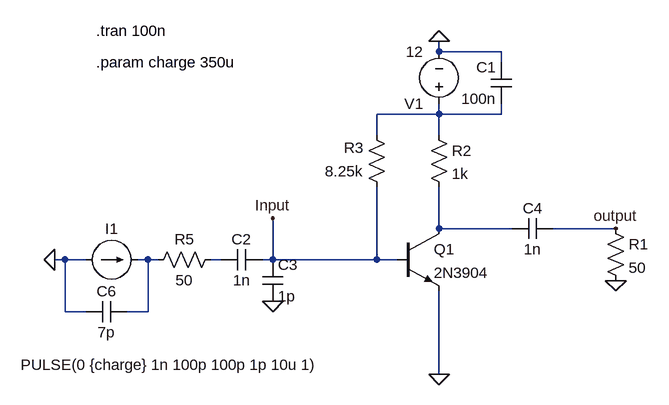
[diagram p0: schematic BGA2803_based_amplifier.asc]
BGA2803_based_amplifier.asc, the LTspice schematic file:
Version 4
SHEET 1 1152 784
WIRE 672 112 672 96
WIRE 768 112 672 112
WIRE 768 128 768 112
WIRE 672 208 672 192
WIRE 672 208 576 208
WIRE 768 208 768 192
WIRE 768 208 672 208
WIRE 576 240 576 208
WIRE 672 240 672 208
WIRE 672 384 672 320
WIRE 784 384 672 384
WIRE 944 384 848 384
WIRE 96 432 80 432
WIRE 128 432 96 432
WIRE 224 432 208 432
WIRE 240 432 224 432
WIRE 336 432 320 432
WIRE 416 432 416 368
WIRE 416 432 400 432
WIRE 576 432 576 320
WIRE 576 432 416 432
WIRE 608 432 576 432
WIRE 96 512 96 432
WIRE 128 512 96 512
WIRE 224 512 224 432
WIRE 224 512 192 512
WIRE 672 608 672 480
FLAG 672 96 0
FLAG 416 496 0
FLAG 672 608 0
FLAG 80 432 0
FLAG 416 368 Input
FLAG 944 384 output
FLAG 944 464 0
SYMBOL voltage 672 208 R180
WINDOW 123 0 0 Left 0
WINDOW 39 0 0 Left 0
SYMATTR InstName V1
SYMATTR Value 12
SYMBOL cap 784 192 R180
WINDOW 0 24 56 Left 2
WINDOW 3 24 8 Left 2
SYMATTR InstName C1
SYMATTR Value 100n
SYMBOL cap 400 416 R90
WINDOW 0 0 32 VBottom 2
WINDOW 3 32 32 VTop 2
SYMATTR InstName C2
SYMATTR Value 1n
SYMBOL cap 400 432 R0
SYMATTR InstName C3
SYMATTR Value 1p
SYMBOL cap 848 368 R90
WINDOW 0 0 32 VBottom 2
WINDOW 3 32 32 VTop 2
SYMATTR InstName C4
SYMATTR Value 1n
SYMBOL res 928 368 R0
SYMATTR InstName R1
SYMATTR Value 50
SYMBOL npn 608 384 R0
SYMATTR InstName Q1
SYMATTR Value 2N3904
SYMBOL res 656 224 R0
SYMATTR InstName R2
SYMATTR Value 1k
SYMBOL current 128 432 R270
WINDOW 0 32 40 VTop 2
WINDOW 3 -146 131 VBottom 2
WINDOW 123 0 0 Left 0
WINDOW 39 0 0 Left 0
SYMATTR InstName I1
SYMATTR Value PULSE(0 {charge} 1n 100p 100p 1p 10u 1)
SYMBOL cap 192 496 R90
WINDOW 0 0 32 VBottom 2
WINDOW 3 32 32 VTop 2
SYMATTR InstName C6
SYMATTR Value 7p
SYMBOL res 336 416 R90
WINDOW 0 0 56 VBottom 2
WINDOW 3 32 56 VTop 2
SYMATTR InstName R5
SYMATTR Value 50
SYMBOL res 592 336 R180
WINDOW 0 36 76 Left 2
WINDOW 3 36 40 Left 2
SYMATTR InstName R3
SYMATTR Value 8.25k
TEXT 144 80 Left 2 !.tran 100n
TEXT 144 128 Left 2 !.param charge 350u

The netlist it stands for:
* BGA2803_based_amplifier.asc
V1 N001 0 12
C1 N001 0 100n
C2 Input N004 1n
C3 Input 0 1p
C4 output N002 1n
R1 output 0 50
Q1 N002 Input 0 0 2N3904
R2 N001 N002 1k
I1 0 N003 PULSE(0 {charge} 1n 100p 100p 1p 10u 1)
C6 N003 0 7p
R5 N004 N003 50
R3 Input N001 8.25k
.model NPN NPN
.model PNP PNP
.lib standard.bjt
.tran 100n
.param charge 350u
.backanno
.end